# EAGLE schematic GPS_module (EAGLE 9.5.0)
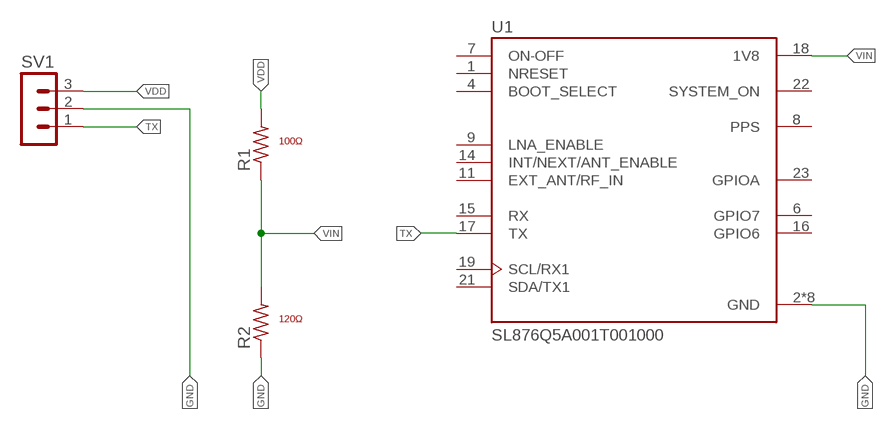
[diagram p0: schematic, sheet 1]

## Parts
R1  100  1623401-1  [RESC2012X65N]
R2  120  1623401-1  [RESC2012X65N]
SV1  MA03-1  [MA03-1]
U1  SL876Q5A001T001000  [XCVR_SL876Q5A001T001000]

## Nets
GND: R2.1 SV1.2 U1.2(GND) U1.3(GND) U1.5(GND) U1.10(GND) U1.12(GND) U1.13(GND) U1.20(GND) U1.24(GND)
TX: SV1.1 U1.17(TX)
VDD: R1.2 SV1.3
VIN: R1.1 R2.2 U1.18(1V8)
Unconnected: U1.1(NRESET) U1.4(BOOT_SELECT) U1.6(GPIO7) U1.7(ON-OFF) U1.8(PPS) U1.9(LNA_ENABLE) U1.11(EXT_ANT/RF_IN) U1.14(INT/NEXT/ANT_ENABLE) U1.15(RX) U1.16(GPIO6) U1.19(SCL/RX1) U1.21(SDA/TX1) U1.22(SYSTEM_ON) U1.23(GPIOA)

## Notes on the sheet
- 100Ω
- 120Ω

## Library data of the parts
R1 R2 = 1623401-1:1623401-1: CRG0805 ZEROHM; AVAILABILITY: Unavailable; COMMENT: 1623401-1; DESCRIPTION: Res Thick Film 0805 0 Ohm Molded SMD SMD T/R; EU_ROHS_COMPLIANCE: Compliant with Exemptions; MF: TE Connectivity; MP: 1623401-1; PACKAGE: 0805; POWER_RATING: .125 W; PRICE: None; RESISTANCE: 0; TE_PURCHASE_URL: https://www.te.com/usa-en/product-1623401-1.html?te_bu=Cor&te_type=disp&te_campaign=seda_glo_cor-seda-global-disp-prtnr-fy19-seda-model-bom-cta_sma-317_1&elqCampaignId=32493; TOLERANCE: 0%; VOLTAGE_RATING: 150 V
SV1 = con-lstb:MA03-1: PIN HEADER; OC_FARNELL: unknown; OC_NEWARK: unknown
U1 = SL876Q5A001T001000:SL876Q5A001T001000: Sl876q5-a Gnss Embedded Module; AVAILABILITY: Unavailable; DESCRIPTION: Sl876q5-a Gnss Embedded Module; MF: Telit; MP: SL876Q5A001T001000; PACKAGE: None; PRICE: None